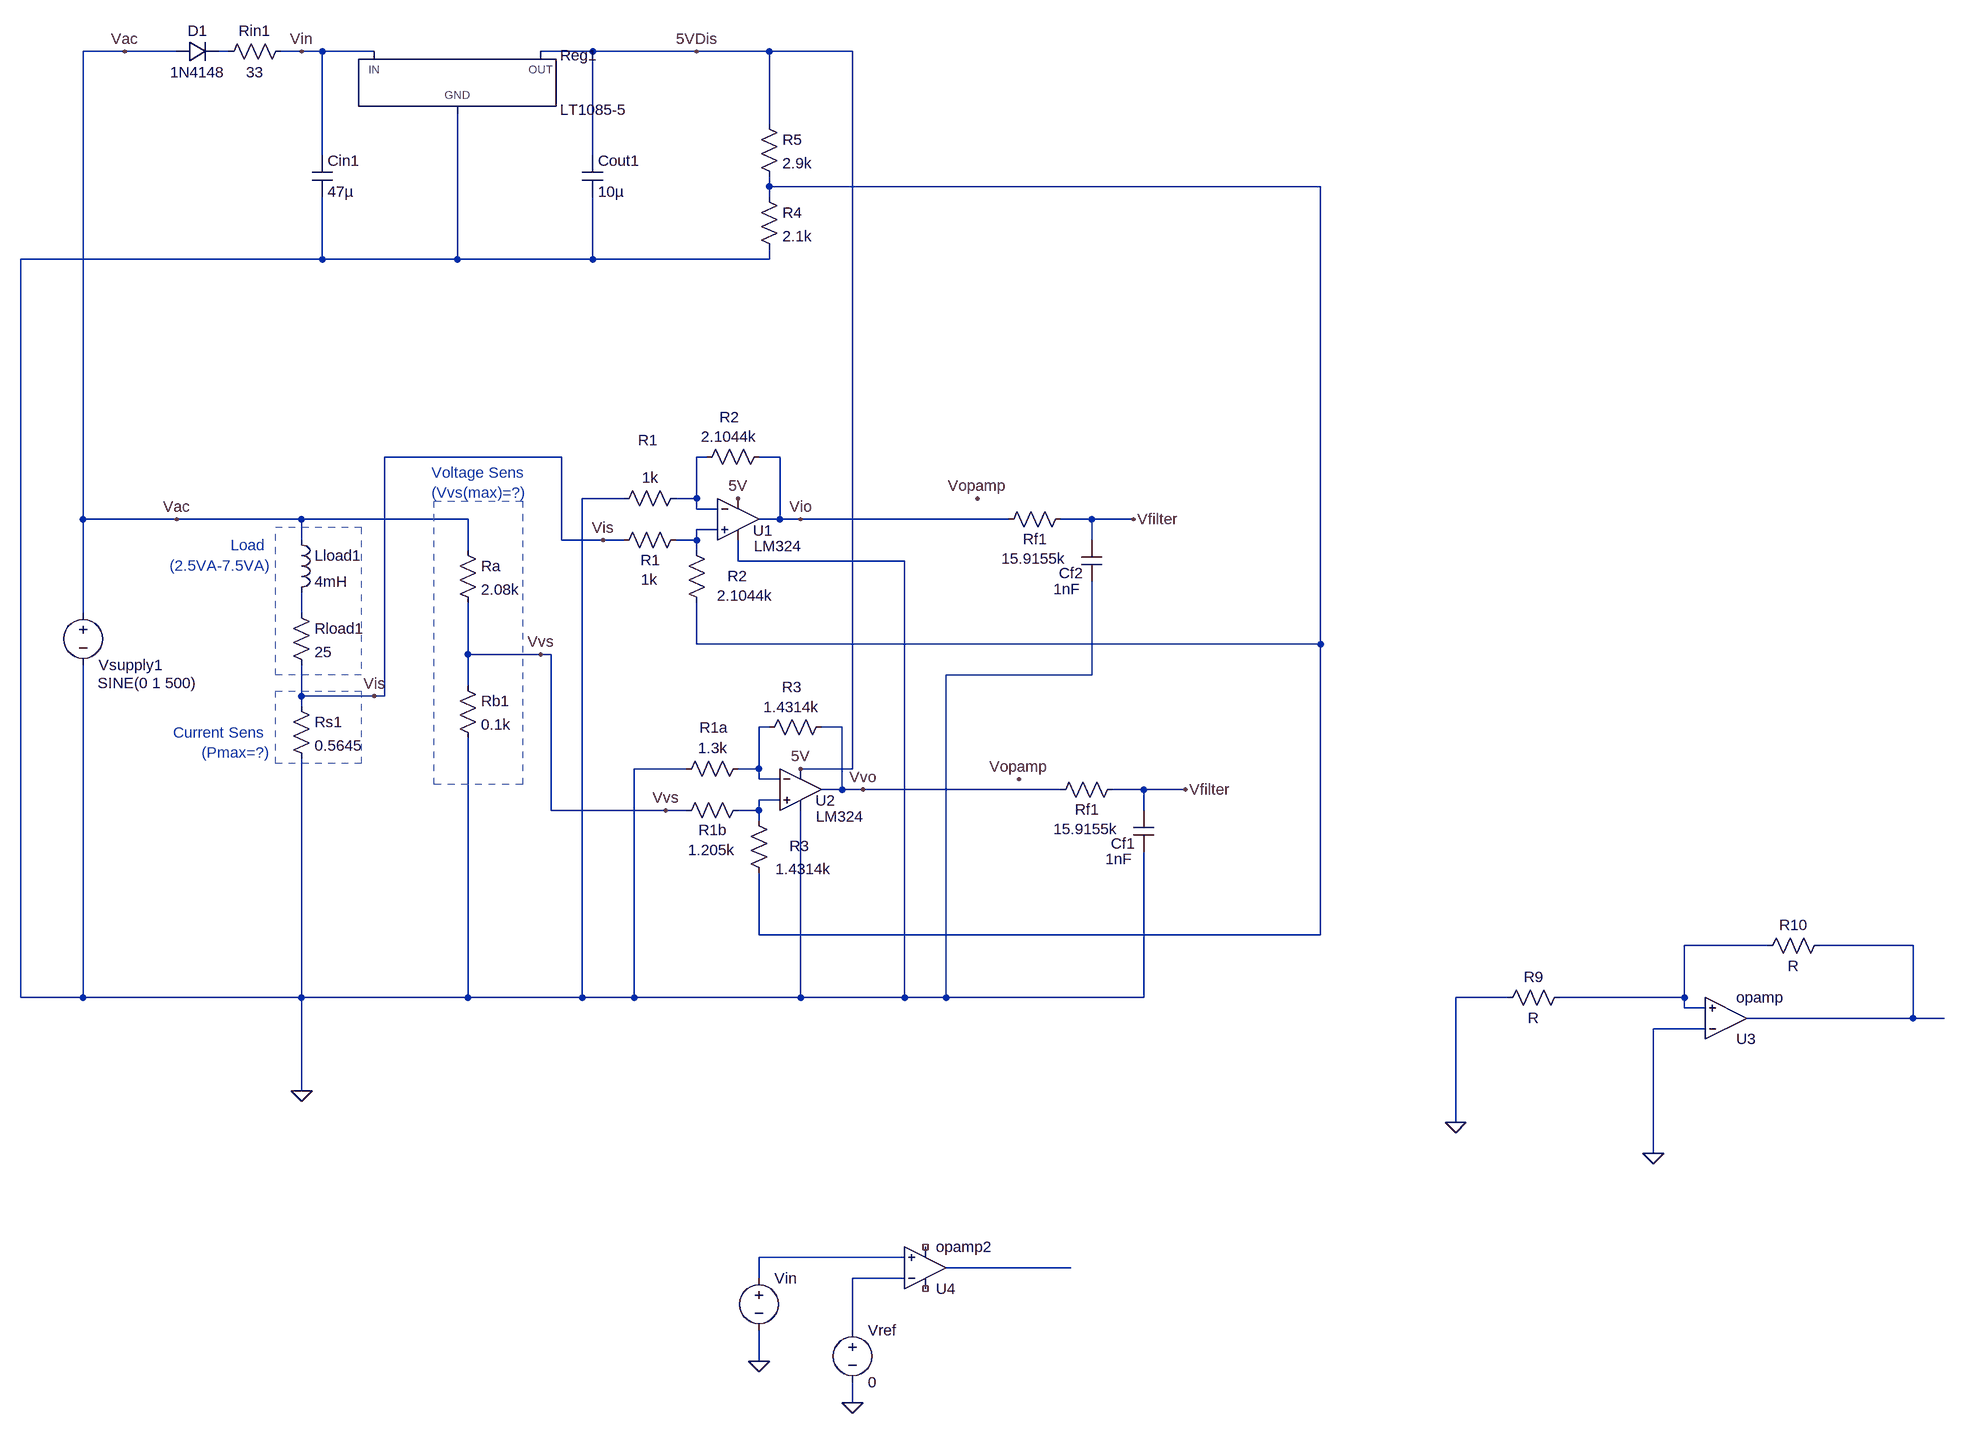
[diagram p0: schematic Ltspice_G5.asc]
Ltspice_G5.asc, the LTspice schematic file:
Version 4
SHEET 1 1332 1364
WIRE -1472 -832 -1536 -832
WIRE -1392 -832 -1472 -832
WIRE -1312 -832 -1328 -832
WIRE -1200 -832 -1232 -832
WIRE -1168 -832 -1200 -832
WIRE -1088 -832 -1168 -832
WIRE -752 -832 -832 -832
WIRE -592 -832 -752 -832
WIRE -480 -832 -592 -832
WIRE -352 -832 -480 -832
WIRE -480 -720 -480 -832
WIRE -1168 -672 -1168 -832
WIRE -752 -672 -752 -832
WIRE -480 -624 -480 -640
WIRE 368 -624 -480 -624
WIRE -480 -608 -480 -624
WIRE -1168 -512 -1168 -608
WIRE -1168 -512 -1632 -512
WIRE -960 -512 -960 -736
WIRE -960 -512 -1168 -512
WIRE -752 -512 -752 -608
WIRE -752 -512 -960 -512
WIRE -480 -512 -480 -528
WIRE -480 -512 -752 -512
WIRE -800 -208 -1072 -208
WIRE -576 -208 -592 -208
WIRE -464 -208 -496 -208
WIRE -704 -144 -768 -144
WIRE -592 -144 -592 -208
WIRE -592 -144 -624 -144
WIRE -592 -128 -592 -144
WIRE -560 -128 -592 -128
WIRE -1536 -112 -1536 -832
WIRE -1392 -112 -1536 -112
WIRE -1200 -112 -1392 -112
WIRE -944 -112 -1200 -112
WIRE -464 -112 -464 -208
WIRE -464 -112 -496 -112
WIRE -432 -112 -464 -112
WIRE -112 -112 -432 -112
WIRE 16 -112 -32 -112
WIRE 80 -112 16 -112
WIRE -560 -96 -592 -96
WIRE -1200 -80 -1200 -112
WIRE -800 -80 -800 -208
WIRE -736 -80 -800 -80
WIRE -704 -80 -736 -80
WIRE -592 -80 -592 -96
WIRE -592 -80 -624 -80
WIRE 16 -80 16 -112
WIRE -944 -64 -944 -112
WIRE -592 -64 -592 -80
WIRE -528 -48 -528 -80
WIRE -272 -48 -528 -48
WIRE -1536 32 -1536 -112
WIRE -1200 32 -1200 0
WIRE -592 80 -592 16
WIRE 368 80 368 -624
WIRE 368 80 -592 80
WIRE -944 96 -944 16
WIRE -832 96 -944 96
WIRE -816 96 -832 96
WIRE 16 128 16 -16
WIRE 16 128 -208 128
WIRE -944 144 -944 96
WIRE -1200 160 -1200 112
WIRE -1088 160 -1200 160
WIRE -1072 160 -1072 -208
WIRE -1072 160 -1088 160
WIRE -1200 176 -1200 160
WIRE -480 208 -496 208
WIRE -368 208 -400 208
WIRE -608 272 -688 272
WIRE -496 272 -496 208
WIRE -496 272 -528 272
WIRE -352 272 -352 -832
WIRE -352 272 -432 272
WIRE -496 288 -496 272
WIRE -464 288 -496 288
WIRE -368 304 -368 208
WIRE -368 304 -400 304
WIRE -336 304 -368 304
WIRE -32 304 -336 304
WIRE 96 304 48 304
WIRE 160 304 96 304
WIRE -464 320 -496 320
WIRE -816 336 -816 96
WIRE -640 336 -816 336
WIRE -608 336 -640 336
WIRE -496 336 -496 320
WIRE -496 336 -528 336
WIRE 96 336 96 304
WIRE -496 352 -496 336
WIRE -496 528 -496 432
WIRE 368 528 368 80
WIRE 368 528 -496 528
WIRE 1056 544 928 544
WIRE 1280 544 1136 544
WIRE -1632 624 -1632 -512
WIRE -1536 624 -1536 112
WIRE -1536 624 -1632 624
WIRE -1200 624 -1200 256
WIRE -1200 624 -1536 624
WIRE -944 624 -944 224
WIRE -944 624 -1200 624
WIRE -768 624 -768 -144
WIRE -768 624 -944 624
WIRE -688 624 -688 272
WIRE -688 624 -768 624
WIRE -432 624 -432 336
WIRE -432 624 -688 624
WIRE -272 624 -272 -48
WIRE -272 624 -432 624
WIRE -208 624 -208 128
WIRE -208 624 -272 624
WIRE 96 624 96 400
WIRE 96 624 -208 624
WIRE 656 624 576 624
WIRE 928 624 928 544
WIRE 928 624 736 624
WIRE 928 640 928 624
WIRE 960 640 928 640
WIRE 1280 656 1280 544
WIRE 1280 656 1024 656
WIRE 1328 656 1280 656
WIRE 960 672 880 672
WIRE -1200 768 -1200 624
WIRE 576 816 576 624
WIRE 880 864 880 672
WIRE -272 1024 -496 1024
WIRE -16 1040 -208 1040
WIRE -496 1056 -496 1024
WIRE -272 1056 -352 1056
WIRE -352 1136 -352 1056
WIRE -496 1184 -496 1136
WIRE -352 1248 -352 1216
FLAG -1392 -112 Vac
FLAG -1088 160 Vis
FLAG -832 96 Vvs
FLAG -528 -144 5V
FLAG -736 -80 Vis
FLAG -432 -112 Vio
FLAG -432 272 5V
FLAG -640 336 Vvs
FLAG -336 304 Vvo
FLAG -1472 -832 Vac
FLAG -592 -832 5VDis
FLAG -1200 -832 Vin
FLAG -96 288 Vopamp
FLAG 160 304 Vfilter
FLAG 576 816 0
FLAG 880 864 0
FLAG -352 1248 0
FLAG -496 1184 0
FLAG -160 -144 Vopamp
FLAG 80 -112 Vfilter
FLAG -1200 768 0
SYMBOL voltage -1536 16 R0
WINDOW 0 24 96 Left 2
WINDOW 3 22 124 Left 2
WINDOW 123 0 0 Left 0
WINDOW 39 0 0 Left 0
SYMATTR InstName Vsupply1
SYMATTR Value SINE(0 1 500)
SYMBOL res -1216 16 R0
SYMATTR InstName Rload1
SYMATTR Value 25
SYMBOL ind -1216 -96 R0
SYMATTR InstName Lload1
SYMATTR Value 4mH
SYMBOL res -1216 160 R0
SYMATTR InstName Rs1
SYMATTR Value 0.5645
SYMBOL res -960 -80 R0
SYMATTR InstName Ra
SYMATTR Value 2.08k
SYMBOL res -960 128 R0
SYMATTR InstName Rb1
SYMATTR Value 0.1k
SYMBOL Opamps/opamp2 -528 -176 R0
WINDOW 0 23 81 Left 2
WINDOW 3 24 105 Left 2
SYMATTR InstName U1
SYMATTR Value LM324
SYMBOL res -608 -96 R90
WINDOW 0 62 55 VBottom 2
WINDOW 3 61 57 VTop 2
SYMATTR InstName R1
SYMATTR Value 1k
SYMBOL res -608 -160 R90
WINDOW 0 -58 59 VBottom 2
WINDOW 3 -32 55 VTop 2
SYMATTR InstName R1
SYMATTR Value 1k
SYMBOL res -480 -224 R90
WINDOW 0 -30 61 VBottom 2
WINDOW 3 -31 62 VTop 2
SYMATTR InstName R2
SYMATTR Value 2.1044k
SYMBOL res -576 32 R180
WINDOW 0 -62 57 Left 2
WINDOW 3 -102 27 Left 2
SYMATTR InstName R2
SYMATTR Value 2.1044k
SYMBOL Opamps/opamp2 -432 240 R0
WINDOW 0 23 81 Left 2
WINDOW 3 24 105 Left 2
SYMATTR InstName U2
SYMATTR Value LM324
SYMBOL res -512 320 R90
WINDOW 0 62 55 VBottom 2
WINDOW 3 61 57 VTop 2
SYMATTR InstName R1b
SYMATTR Value 1.205k
SYMBOL res -512 256 R90
WINDOW 0 -32 53 VBottom 2
WINDOW 3 -32 55 VTop 2
SYMATTR InstName R1a
SYMATTR Value 1.3k
SYMBOL res -384 192 R90
WINDOW 0 -30 61 VBottom 2
WINDOW 3 -31 62 VTop 2
SYMATTR InstName R3
SYMATTR Value 1.4314k
SYMBOL res -480 448 R180
WINDOW 0 -62 57 Left 2
WINDOW 3 -96 22 Left 2
SYMATTR InstName R3
SYMATTR Value 1.4314k
SYMBOL PowerProducts/LT1085-5 -960 -832 R0
SYMATTR InstName Reg1
SYMBOL res -496 -736 R0
SYMATTR InstName R5
SYMATTR Value 2.9k
SYMBOL res -1216 -848 R90
WINDOW 0 0 56 VBottom 2
WINDOW 3 32 56 VTop 2
SYMATTR InstName Rin1
SYMATTR Value 33
SYMBOL diode -1392 -816 R270
WINDOW 0 32 32 VTop 2
WINDOW 3 0 32 VBottom 2
SYMATTR InstName D1
SYMATTR Value 1N4148
SYMBOL cap -1184 -672 R0
SYMATTR InstName Cin1
SYMATTR Value 47µ
SYMATTR SpiceLine Rser=0.001
SYMBOL cap -768 -672 R0
SYMATTR InstName Cout1
SYMATTR Value 10µ
SYMATTR SpiceLine Rser=0.001
SYMBOL res 64 288 R90
WINDOW 0 62 55 VBottom 2
WINDOW 3 61 57 VTop 2
SYMATTR InstName Rf1
SYMATTR Value 15.9155k
SYMBOL cap 112 400 R180
WINDOW 0 29 13 Left 2
WINDOW 3 33 -11 Left 2
SYMATTR InstName Cf1
SYMATTR Value 1nF
SYMBOL res 752 608 R90
WINDOW 0 0 56 VBottom 2
WINDOW 3 32 56 VTop 2
SYMATTR InstName R9
SYMBOL res 1152 528 R90
WINDOW 0 0 56 VBottom 2
WINDOW 3 32 56 VTop 2
SYMATTR InstName R10
SYMBOL OpAmps\\opamp 992 720 M180
SYMATTR InstName U3
SYMBOL OpAmps\\opamp2 -240 1104 M180
SYMATTR InstName U4
SYMBOL voltage -496 1040 R0
WINDOW 123 0 0 Left 0
WINDOW 39 0 0 Left 0
SYMATTR InstName Vin
SYMATTR Value ""
SYMBOL voltage -352 1120 R0
WINDOW 123 0 0 Left 0
WINDOW 39 0 0 Left 0
SYMATTR InstName Vref
SYMATTR Value 0
SYMBOL res -16 -128 R90
WINDOW 0 62 55 VBottom 2
WINDOW 3 61 57 VTop 2
SYMATTR InstName Rf1
SYMATTR Value 15.9155k
SYMBOL cap 32 -16 R180
WINDOW 0 29 13 Left 2
WINDOW 3 33 -11 Left 2
SYMATTR InstName Cf2
SYMATTR Value 1nF
SYMBOL res -496 -624 R0
SYMATTR InstName R4
SYMATTR Value 2.1k
TEXT -1248 -72 Right 2 ;Load \n(2.5VA-7.5VA)
TEXT -1248 216 Right 2 ;Current Sens \n(Pmax=?)
TEXT -1000 -184 Left 2 ;Voltage Sens\n(Vvs(max)=?)
RECTANGLE Normal -996 -140 -860 296 2
RECTANGLE Normal -1240 -100 -1108 128 2
RECTANGLE Normal -1240 152 -1108 264 2

The netlist it stands for:
* Ltspice_G5.asc
Vsupply1 Vac 0 SINE(0 1 500)
Rload1 N005 Vis 25
Lload1 Vac N005 4mH
Rs1 Vis 0 0.5645
Ra Vac Vvs 2.08k
Rb1 Vvs 0 0.1k
XU1 N004 N003 5VDis 0 Vio LM324  ; pins In+ In- V+ V- OUT
R1 N004 Vis 1k
R1 N003 0 1k
R2 Vio N003 2.1044k
R2 N002 N004 2.1044k
XU2 N007 N006 5VDis 0 Vvo LM324  ; pins In+ In- V+ V- OUT
R1b N007 Vvs 1.205k
R1a N006 0 1.3k
R3 Vvo N006 1.4314k
R3 N002 N007 1.4314k
XReg1 0 5VDis Vin LT1085-5  ; pins GND OUT IN
R5 5VDis N002 2.9k
Rin1 Vin N001 33
D1 Vac N001 1N4148
Cin1 Vin 0 47µ Rser=0.001
Cout1 5VDis 0 10µ Rser=0.001
Rf1 Vfilter Vvo 15.9155k
Cf1 0 Vfilter 1nF
R9 N008 0 R
R10 N009 N008 R
XU3 0 N008 N009 opamp Aol=100K GBW=10Meg  ; pins invin noninvin out
XU4 N010 N012 NC_01 NC_02 N011 opamp2  ; pins In+ In- V+ V- OUT
Vin N010 0
Vref N012 0 0
Rf1 Vfilter Vio 15.9155k
Cf2 0 Vfilter 1nF
R4 N002 0 2.1k
.model D D
.lib standard.dio
* Load
* (2.5VA-7.5VA)
* Current Sens
* (Pmax=?)
* Voltage Sens
* (Vvs(max)=?)
.backanno
.end